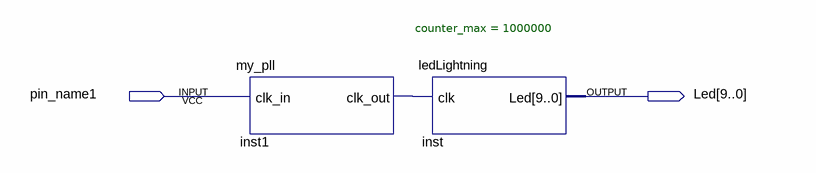
[diagram p0: schematic sheet]
// Quartus schematic Lab4.bdf as structural Verilog: 2 symbols, 2 pins
module Lab4 (
  input  pin_name1,
  output [9:0] Led
);

  wire inst1_clk_out;

  my_pll #(.counter_max(1000000)) inst1 (.clk_in(pin_name1), .clk_out(inst1_clk_out));
  ledLightning inst (.clk(inst1_clk_out), .Led(Led));
endmodule
